# EAGLE design FilamentMonitor-1.0 (EAGLE 7.4.0)
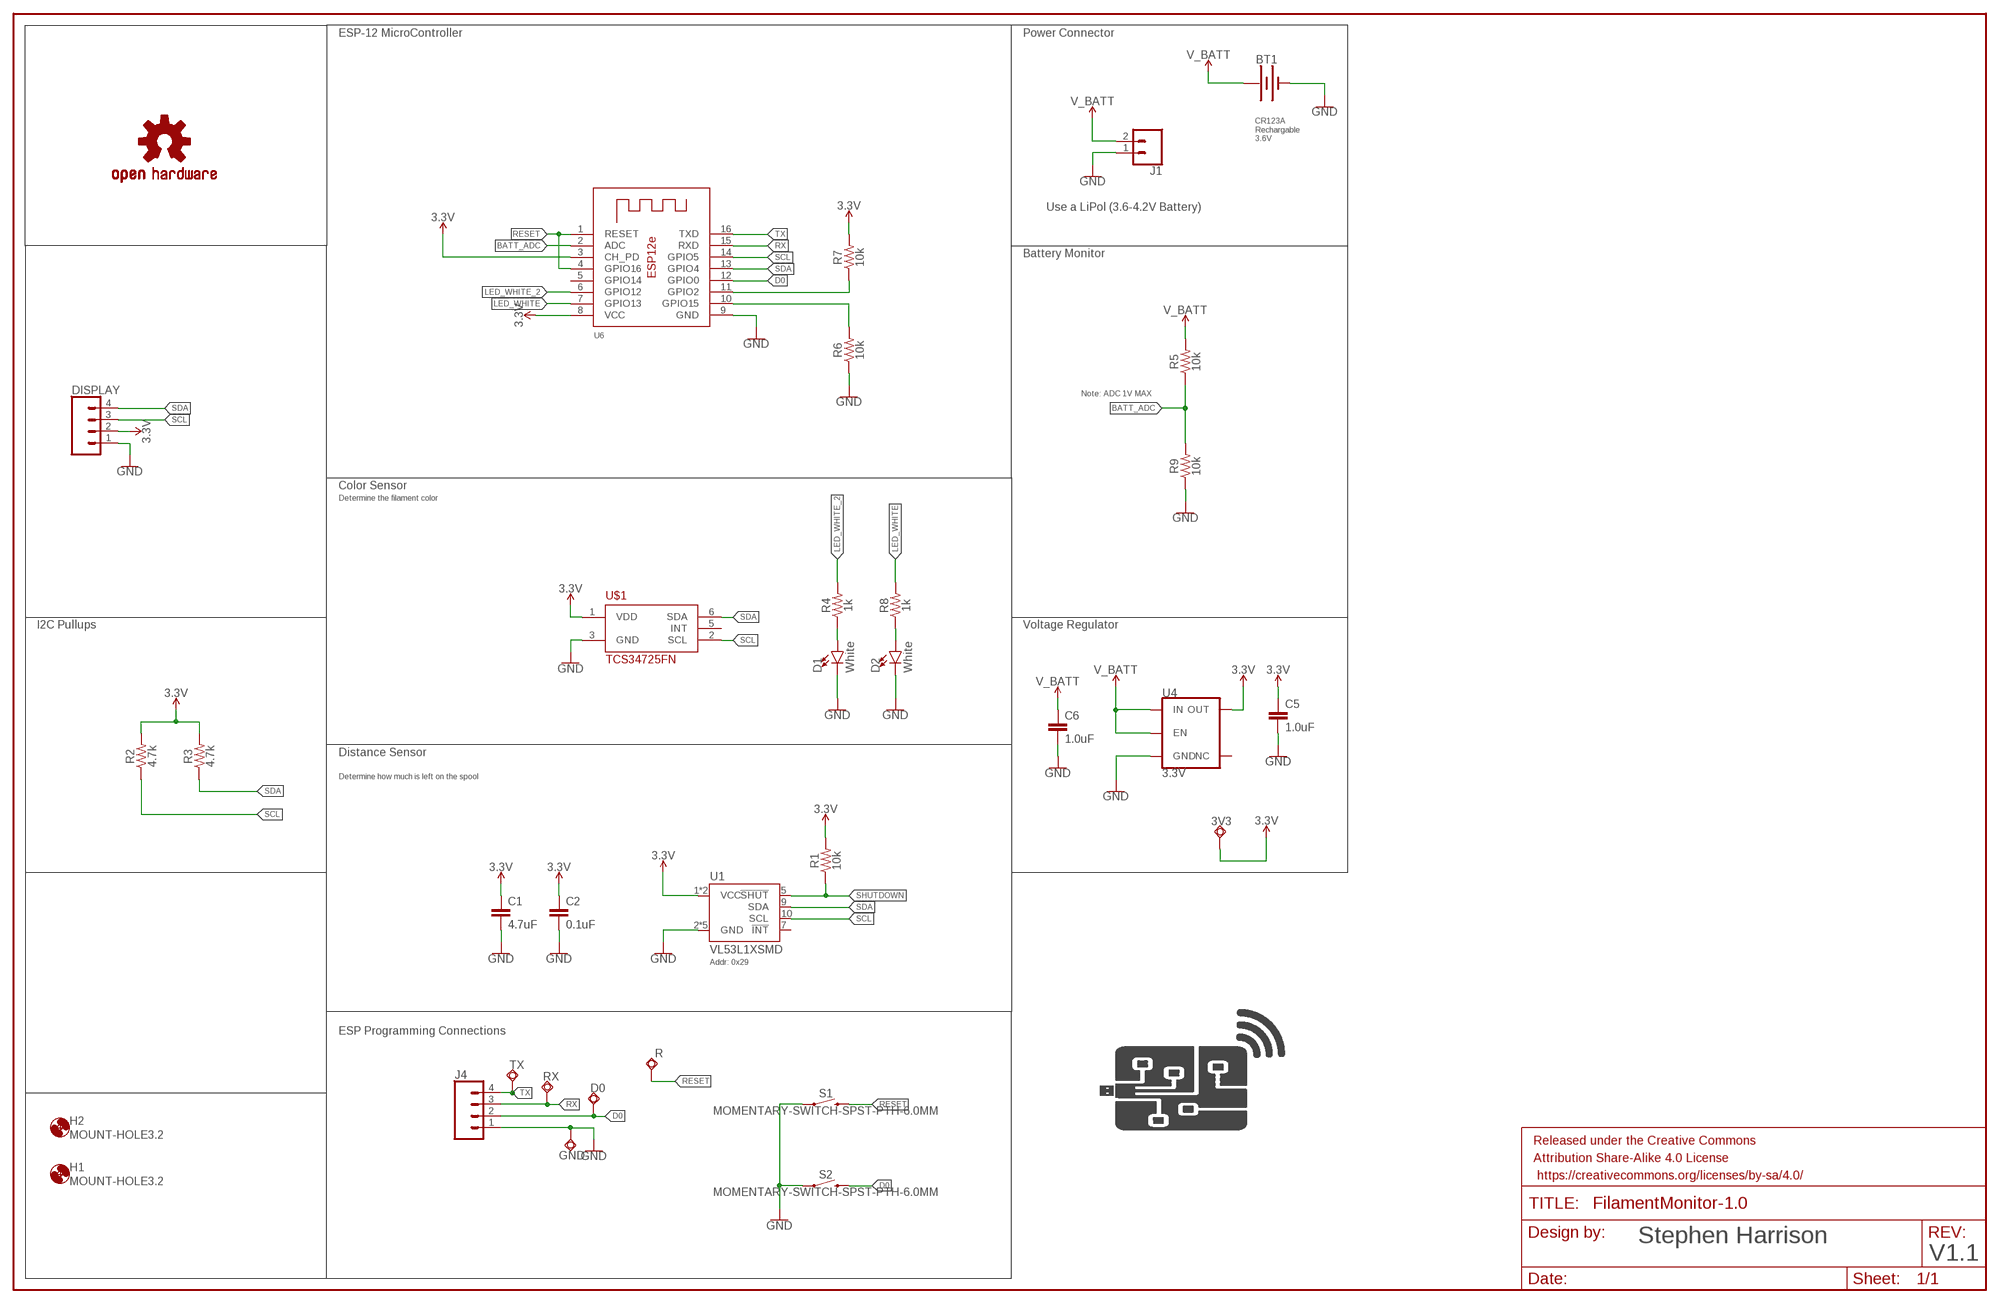
[diagram p0: schematic, sheet 1]

## Parts
3V3  TPSQTP10SQ  [TP10SQ]
BT1  BATTERY-16340  [BATTERY_16340-HOLDER]
C1  4.7uF  4.7UF-0603-6.3V-(10%)  [0603]
C2  0.1uF  0.1UF-0603-25V-5%  [0603]
C5  1.0uF  0.1UF-0603-25V-5%  [0603]
C6  1.0uF  0.1UF-0603-25V-5%  [0603]
D0  TPSQTP10SQ  [TP10SQ]
D1  White  LED-GREEN1206  [LED-1206]
D2  White  LED-GREEN1206  [LED-1206]
DISPLAY  CONN_04  [1X04]
FRAME1  FRAME-LEDGER  [CREATIVE_COMMONS]
GND  TPSQTP10SQ  [TP10SQ]
H1  MOUNT-HOLE3.2  [3,2]
H2  MOUNT-HOLE3.2  [3,2]
J1  CONN_02-JST-2MM-SMT  [JST-2-SMD]
J4  CONN_04  [1X04]
LOGO1  OSHW-LOGOL  [OSHW-LOGO-L]
R  TPSQTP10SQ  [TP10SQ]
R1  10k  10KOHM-0603-1/10W-1%  [0603]
R2  4.7k  4.7KOHM-0603-1/10W-1%  [0603]
R3  4.7k  4.7KOHM-0603-1/10W-1%  [0603]
R4  1k  RESISTOR0805  [0805]
R5  10k  10KOHM-0603-1/10W-1%  [0603]
R6  10k  10KOHM-0603-1/10W-1%  [0603]
R7  10k  10KOHM-0603-1/10W-1%  [0603]
R8  1k  RESISTOR0805  [0805]
R9  10k  10KOHM-0603-1/10W-1%  [0603]
RX  TPSQTP10SQ  [TP10SQ]
S1  MOMENTARY-SWITCH-SPST-PTH-6.0MM  [TACTILE_SWITCH_PTH_6.0MM]
S2  MOMENTARY-SWITCH-SPST-PTH-6.0MM  [TACTILE_SWITCH_PTH_6.0MM]
TX  TPSQTP10SQ  [TP10SQ]
U1  VL53L1XSMD  [VL53L1X]
U4  3.3V  V_REG_AP2112K-3.3V  [SOT23-5]
U6  ESP-12E  [ESP-12E]
U$1  TCS34725FN  TCS3472  [FN-6]
U$2  THINGYSTICKS_LOGO  [THINGYSTICKS_LOGO]

## Nets
3.3V: 3V3.TP C1.1 C2.1 C5.1 DISPLAY.2 R1.2 R2.2 R3.2 R7.2 U1.1(VCC) U1.11(VCC) U4.5(OUT) U6.3(CH_PD) U6.8(VCC) U$1.1(VDD)
ACCEL_INT_2: R7.1 U6.11(GPIO2)
BATT_ADC: R5.1 R9.2 U6.2(ADC)
D0: D0.TP J4.2 S2.3 U6.12(GPIO0)
GND: BT1.P$2(-) C1.2 C2.2 C5.2 C6.2 D1.C D2.C DISPLAY.1 GND.TP J1.1 J4.1 R6.1 R9.1 S1.1 S2.1 U1.2(GND) U1.3(GND) U1.4(GND) U1.6(GND) U1.12(GND) U4.2(GND) U6.9(GND) U$1.3(GND)
GPIO15: R6.2 U6.10(GPIO15)
LED_WHITE: R8.2 U6.7(GPIO13)
LED_WHITE_2: R4.2 U6.6(GPIO12)
N$1: D2.A R8.1
N$2: D1.A R4.1
RESET: R.TP S1.3 U6.1(RESET) U6.4(GPIO16)
RX: J4.3 RX.TP U6.15(RXD)
SCL: DISPLAY.3 R2.1 U1.10(SCL) U6.14(GPIO5) U$1.2(SCL)
SDA: DISPLAY.4 R3.1 U1.9(SDA) U6.13(GPIO4) U$1.6(SDA)
SHUTDOWN: R1.1 U1.5(!SHUT)
TX: J4.4 TX.TP U6.16(TXD)
V_BATT: BT1.P$1(+) C6.1 J1.2 R5.2 U4.1(IN) U4.3(EN)
Unconnected: U1.7(!INT) U4.4(NC) U6.5(GPIO14) U$1.5(INT)

## Notes on the sheet
- ESP-12 MicroController | Power Connector
- CR123A 
  Rechargable
  3.6V
- Use a LiPol (3.6-4.2V Battery)
- Battery Monitor
- Note: ADC 1V MAX
- Color Sensor
- Determine the filament color
- I2C Pullups | Voltage Regulator
- Distance Sensor
- Determine how much is left on the spool
- Addr: 0x29
- ESP Programming Connections
- Stephen Harrison
- V1.1

## Library data of the parts
3V3 D0 GND R RX TX = testpad:TPSQ: Test pad
BT1 = ThingySticks:BATTERY: Battery - Single Cell A variety of battery chemistries, sizes, and footprints. Device List: 20MM_PTH - Coin Cell Battery Holder - 20mm (PTH) <https://www.sparkfun.com/products/783> 12MM_SMD - Coin Cell Battery Holder - 12mm (SMD) <https://www.sparkfun.com/products/10592> 12MM_PTH - Coin Cell Battery Holder - 12mm (PTH) <https://www.sparkfun.com/products/7948> 20MM_SMD - 20mm Coin Cell Battery Holder (SMD) (2 legs) Used on the Big Time Watch Kit <https://www.sparkfun.com/products/11734> 20MM_SMD_4LEGS - Coin Cell Battery Holder - 20mm (SMD) <https://www.sparkfun.com/products/11892> 20MM_SMD_4LEGS_OVERPASTE - Coin Cell Battery Holder - 20mm (SMD) <https://www.sparkfun.com/products/11892> (Over-paste on the legs) 24.5MM_PTH - Coin Cell Battery Holder - 24.5mm (PTH) <https://www.sparkfun.com/products/8863> 9V - 9V Battery Holder - PC Mount Used on the SparkFun SparkPunk Sound Kit <https://www.sparkfun.com/products/11177> and SparkFun SparkPunk Sequencer Kit <https://www.sparkfun.com/products/12707> 18650 - Battery Holder - 18650 (PTH) <https://www.sparkfun.com/products/13113> AA - Battery Holder - 1xAA (PTH) <https://www.sparkfun.com/products/7949> AAA - Battery Holder - 1xAAA (PTH) <https://www.sparkfun.com/products/12718> AA_KIT - Battery Holder - 1xAA (PTH) <https://www.sparkfun.com/products/7949> Special kit package - pads only have exposed copper on one side of the board. AAA_KIT - Battery Holder - 1xAAA (PTH) <https://www.sparkfun.com/products/12718> Special kit package - pads only have exposed copper on one side of the board.
C1 = SparkFun-Capacitors:4.7UF: 4.7µF ceramic capacitors A capacitor is a passive two-terminal electrical component used to store electrical energy temporarily in an electric field.; PROD_ID: CAP-08280
C2 = SparkFun-Capacitors:0.1UF: 0.1µF ceramic capacitors A capacitor is a passive two-terminal electrical component used to store electrical energy temporarily in an electric field.; PROD_ID: CAP-08604
C5 C6 = SparkFun-Capacitors:0.1UF: 0.1µF ceramic capacitors A capacitor is a passive two-terminal electrical component used to store electrical energy temporarily in an electric field.; PROD_ID: CAP-08604; VALUE: 0.1uF
D1 D2 = SparkFun-LED:LED-GREEN: Green SMD LED Used in manufacturing of various products at SparkFun Packages: 0603 - SMD 0603 package [Product Link] <http://www.futureelectronics.com/en/technologies/semiconductors/optoelectronics/leds/Pages/9894312-LTST-C190GKT.aspx?CrossPart=HSMG-C190&IM=0> LilyPad 1206 - SMD1206 LilyPad package [Product Link] <http://www.futureelectronics.com/en/Technologies/Product.aspx?ProductID=IN150NGHARVATEKCORPORATION2049943&IM=0> 1206 - SMD1206 package [Product Link] <http://www.futureelectronics.com/en/technologies/semiconductors/optoelectronics/leds/Pages/8315665-LTST-C150KGKT.aspx?IM=0> 1206 Bottom Mount -SMD 1206 Bottom Mount [Product Link] <http://www.digikey.com/product-detail/en/lite-on-inc/LTST-C230KGKT/160-1456-1-ND/386854> SparkFun Products: Pro Mini 328 -5V <https://www.sparkfun.com/products/821> RedBoard <https://www.sparkfun.com/products/12757> MP3 Trigger <https://www.sparkfun.com/products/13720> Makey Makey <https://www.sparkfun.com/products/11076>; PROD_ID: DIO-00862; VALUE: GREEN
DISPLAY J4 = ThingySticks:CONN_04: Multi connection point. Often used as Generic Header-pin footprint for 0.1 inch spaced/style header connections On any of the 0.1 inch spaced packages, you can populate with these: Break Away Headers - Straight <https://www.sparkfun.com/products/116> (PRT-00116) Break Away Male Headers - Right Angle <https://www.sparkfun.com/products/553> (PRT-00553) Female Headers <https://www.sparkfun.com/products/115> (PRT-00115) Break Away Headers - Machine Pin <https://www.sparkfun.com/products/117> (PRT-00117) Break Away Female Headers - Swiss Machine Pin <https://www.sparkfun.com/products/743> (PRT-00743) For SCREWTERMINALS and SPRING TERMINALS visit here: Screw Terimnals on SparkFun.com <https://www.sparkfun.com/search/results?term=Screw+Terminals> (5mm/3.5mm/2.54mm spacing) This device is also useful as a general connection point to wire up your design to another part of your project. Our various solder wires solder well into these plated through hole pads. Hook-Up Wire - Assortment (Stranded, 22 AWG) <https://www.sparkfun.com/products/11375> (PRT-11375) Hook-Up Wire - Assortment (Solid Core, 22 AWG) <https://www.sparkfun.com/products/11367> (PRT-11367) View the entire wire category on our website here <https://www.sparkfun.com/categories/141> Special notes: Molex polarized connector foot print use with SKU : PRT-08231 with associated crimp pins and housings. 1MM SMD Version SKU: PRT-10208; PROD_ID: CONN-09696
FRAME1 = SparkFun-Aesthetics:FRAME-LEDGER: Schematic Frame - Ledger Standard 11x14 US Ledger frame
H1 H2 = holes:MOUNT-HOLE: MOUNTING HOLE with drill center marker
J1 = SparkFun-Connectors:CONN_02: Multi connection point. Often used as Generic Header-pin footprint for 0.1 inch spaced/style header connections On any of the 0.1 inch spaced packages, you can populate with these: Break Away Headers - Straight <https://www.sparkfun.com/products/116> (PRT-00116) Break Away Male Headers - Right Angle <https://www.sparkfun.com/products/553> (PRT-00553) Female Headers <https://www.sparkfun.com/products/115> (PRT-00115) Break Away Headers - Machine Pin <https://www.sparkfun.com/products/117> (PRT-00117) Break Away Female Headers - Swiss Machine Pin <https://www.sparkfun.com/products/743> (PRT-00743) For SCREWTERMINALS and SPRING TERMINALS visit here: Screw Terimnals on SparkFun.com <https://www.sparkfun.com/search/results?term=Screw+Terminals> (5mm/3.5mm/2.54mm spacing) This device is also useful as a general connection point to wire up your design to another part of your project. Our various solder wires solder well into these plated through hole pads. Hook-Up Wire - Assortment (Stranded, 22 AWG) <https://www.sparkfun.com/products/11375> (PRT-11375) Hook-Up Wire - Assortment (Solid Core, 22 AWG) <https://www.sparkfun.com/products/11367> (PRT-11367) View the entire wire category on our website here <https://www.sparkfun.com/categories/141> Special notes: Molex polarized connector foot print use with: PRT-08233 with associated crimp pins and housings. 2.54_SCREWTERM for use with PRT-10571. 3.5mm Screw Terminal footprints for PRT-08084 5mm Screw Terminal footprints for use with PRT-08432; PROD_ID: CONN-11443
LOGO1 = SparkFun-Aesthetics:OSHW-LOGO: Open-Source Hardware (OSHW) Logo This logo indicates the piece of hardware it is found on incorporates a OSHW license and/or adheres to the definition of open source hardware found here: http://freedomdefined.org/OSHW
R1 R5-R7 R9 = SparkFun-Resistors:10KOHM: 10kΩ resistor A resistor is a passive two-terminal electrical component that implements electrical resistance as a circuit element. Resistors act to reduce current flow, and, at the same time, act to lower voltage levels within circuits. - Wikipedia; PROD_ID: RES-00824
R2 R3 = SparkFun-Resistors:4.7KOHM: 4.7kΩ resistor A resistor is a passive two-terminal electrical component that implements electrical resistance as a circuit element. Resistors act to reduce current flow, and, at the same time, act to lower voltage levels within circuits. - Wikipedia; PROD_ID: RES-07857
R4 R8 = SparkFun-Resistors:RESISTOR: Generic Resistor Package
S1 S2 = SparkFun-Switches:MOMENTARY-SWITCH-SPST: Momentary Switch (Pushbutton) - SPST Normally-open (NO) SPST momentary switches (buttons, pushbuttons). Variants PTH-12MM - 12mm square, through-hole Momentary Pushbutton Switch - 12mm Square <https://www.sparkfun.com/products/9190> (COM-09190) PTH-6.0MM, PTH-6.0MM-KIT - 6.0mm square, through-hole Mini Pushbutton Switch <https://www.sparkfun.com/products/97> (COM-00097) KIT package intended for soldering kit's - only one side of pads' copper is exposed. PTH-RIGHT-ANGLE-KIT - Right-angle, through-hole Right Angle Tactile Button <https://www.sparkfun.com/products/10791> - Used on SparkFun BigTime Watch Kit <https://www.sparkfun.com/products/11734> SMD-12MM - 12mm square, surface-mount Tactile Button - SMD (12mm) <https://www.sparkfun.com/products/12993> (COM-12993) Used on SparkFun PicoBoard <https://www.sparkfun.com/products/11888> SMD-4.5MM - 4.5mm Square Trackball Switch Used on SparkFun Blackberry Trackballer Breakout <https://www.sparkfun.com/products/13169> SMD-4.6MMX2.8MM - 4.60mm x 2.80mm, surface mount Used on SparkFun SAMD21 Mini Breakout <https://www.sparkfun.com/products/13664> SMD-5.2MM, SMD-5.2-REDUNDANT - 5.2mm square, surface-mount Mini Pushbutton Switch - SMD <https://www.sparkfun.com/products/8720> (COM-08720) Used on Arduino Pro Mini <https://www.sparkfun.com/products/11114> REDUNDANT package connects both switch circuits together SMD-6.0X3.5MM - 6.0 x 3.5mm, surface mount Momentary Reset Switch SMD <https://www.sparkfun.com/products/8229> (COM-08229) SMD-6.2MM-TALL - 6.2mm square, surface mount Tactile Button - SMD (6mm) <https://www.sparkfun.com/products/12992> Used on SparkFun Digital Sandbox <https://www.sparkfun.com/products/12651> SMD-RIGHT-ANGLE - Right-angle, surface mount Used on SparkFun Block for Intel® Edison - Arduino <https://www.sparkfun.com/products/13036>; PROD_ID: SWCH-08441; SF_SKU: COM-00097
U1 = SparkFun-Sensors:VL53L1X: STMicroelectronics VL53L1X - 400 cm IR Laser ToF Sensor VL53L1X is a state-of-the-art ToF laser-ranging sensor, enhancing the ST FlightSense product family. It is the fastest miniature ToF sensor currently on the market with accurate ranging up to 4 m and fast ranging frequency (up to 50 Hz). Housed in a miniature and reflowable package, it integrates a single photon avalanche diode (SPAD) receiving array, a 940 nm invisible laser Class 1 emitter, physical infrared filters, and optics to achieve the best ranging performance in various ambient lighting conditions with a range of cover window options.; PROD_ID: IC-13960
U4 = SparkFun-IC-Power:V_REG_AP2112: AP2112 - 600mA CMOS LDO Regulator w/ Enable The AP2112 is CMOS process low dropout linear regulator with enable function, the regulator delivers a guaranteed 600mA (min.) continuous load current. Features Output Voltage Accuracy: ±1.5% Output Current: 600mA (Min.) Foldback Short Current Protection: 50mA Enable Function to Turn ON/OFF VOUT Low Dropout Voltage (3.3V): 250mV (Typ.) @IOUT=600mA Excellent Load Regulation: 0.2%/A (Typ.) Excellent Line Regulation: 0.02%/V (Typ.) Low Quiescent Current: 55μA (Typ.) Low Standby Current: 0.01μA (Typ.) Low Output Noise: 50μVRMS PSRR: 100Hz -65dB, 1kHz -65dB OTSD Protection Stable with 1.0μF Flexible Cap: Ceramic, Tantalum and Aluminum Electrolytic Operation Temperature Range: -40°C to 85°C ESD: MM 400V, HBM 4000V; PROD_ID: VREG-12457
U6 = kanflo:ESP-12E: ESP12e module This is a copy of AdaFruit's device with correct pin order for GPIO4 and GPIO5.
U$1 = ThingySticks:TCS3472; COST: 2.18; MFG: TCS34725FN; MOUSER: 985-TCS34725FN
U$2 = ThingySticks:THINGYSTICKS_LOGO

## Board
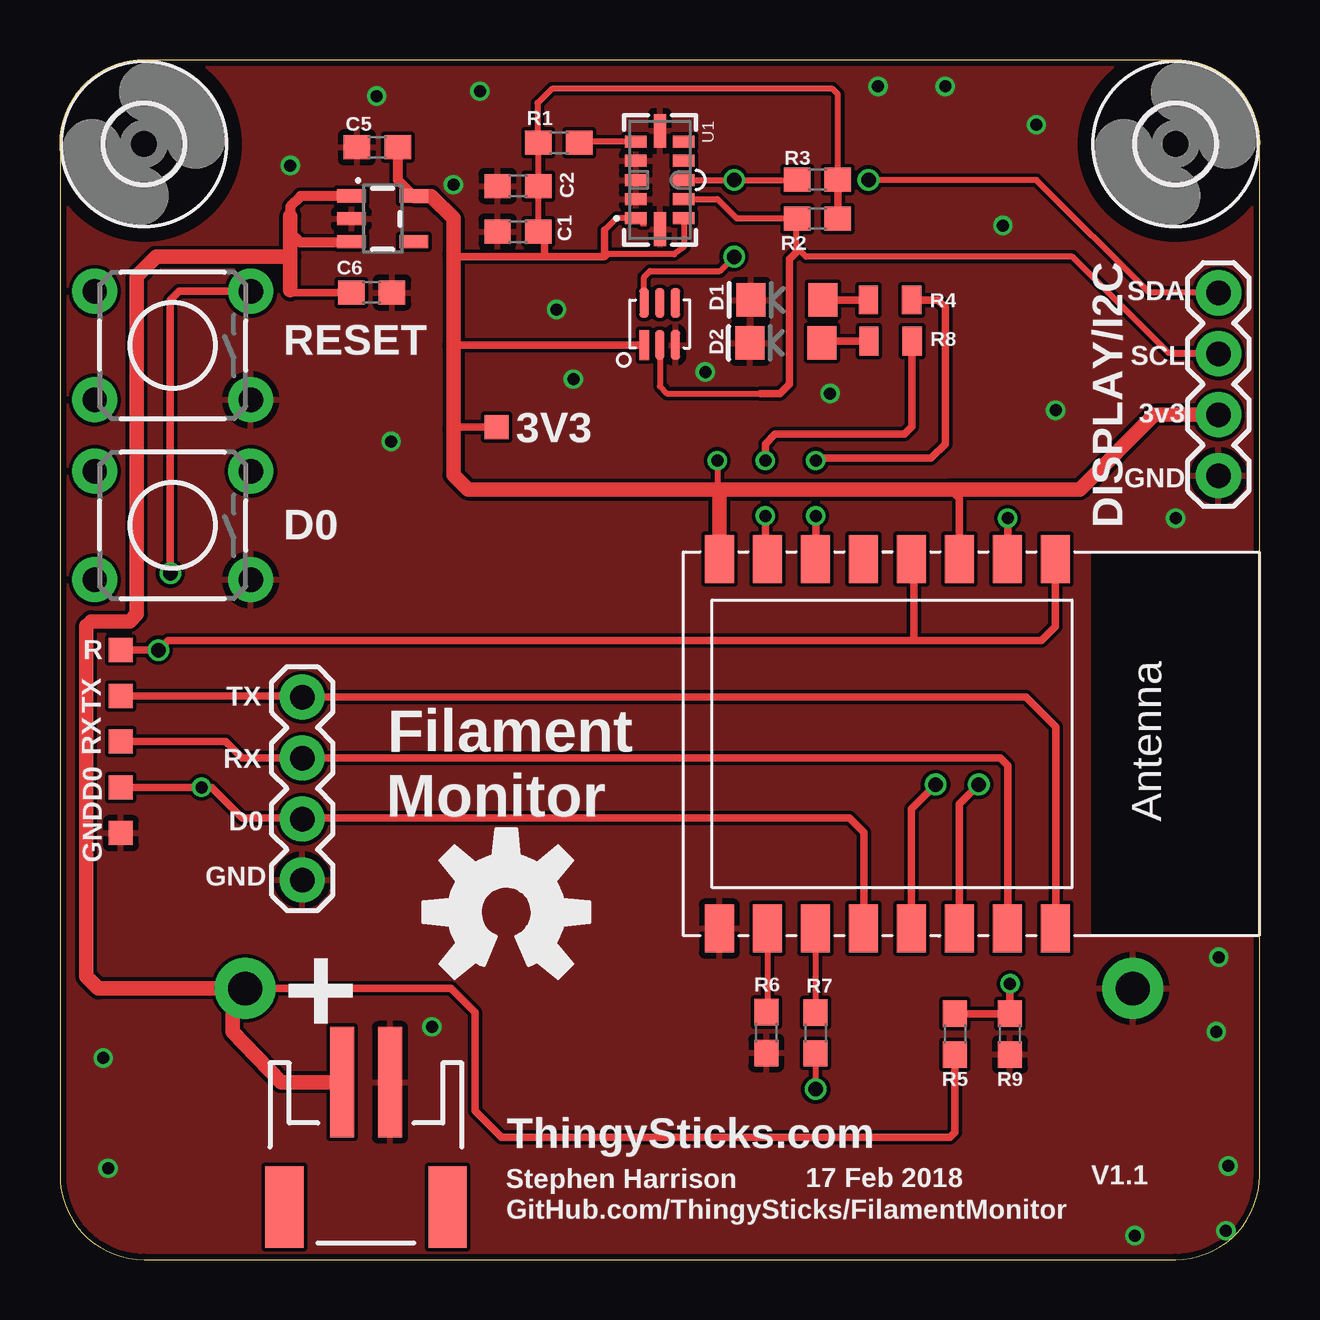
[diagram p1: board, top side]
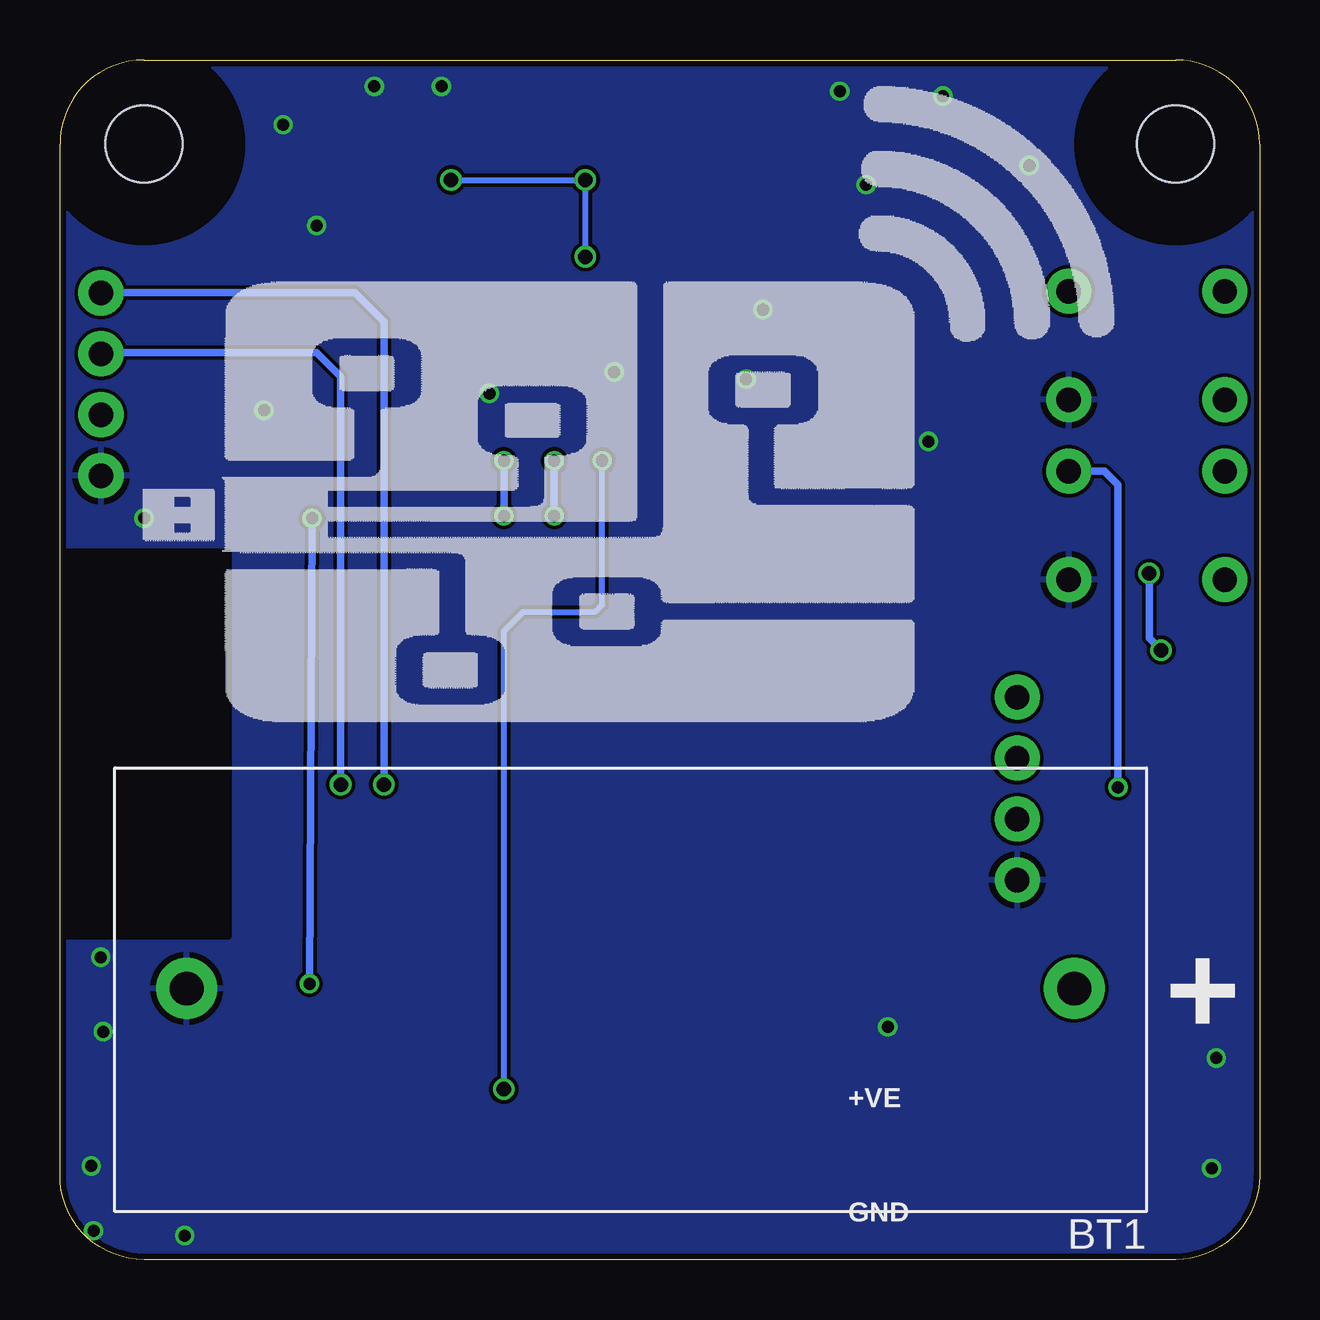
[diagram p2: board, bottom side, seen from below]

Size 50 x 50 mm. Coordinates in mm from the lower left corner, seen from the top.
Outline: 3.5,0 46.5,0 arc90 50,3.5 50,46.5 arc90 46.5,50 3.5,50 arc90 0,46.5 0,3.5 arc90 3.5,0
Copper layers (1*16): Top 0.035mm / dielectric 1.5mm / Bottom 0.035mm
Design rules "dirt_cheap_dirty_boards.v1.1": minimum track width 6mil, minimum drill 12mil, track to track 6mil, track to pad 6mil, pad to pad 6mil, via to via 6mil, smd to smd 0mil, copper to edge 10mil, drill to drill 10mil, minimum pad ring 10mil, minimum via ring 6mil, stop-mask expansion 2mil, vias tented up to drill 25mil, thermal gap 10mil

### Footprints (pad centres in the part's own frame; a part is rotated, then mirrored left to right if it is on the bottom)
TP10SQ = smd 1 x 1: TP 0,0
BATTERY_16340-HOLDER = drill 1.4 pad 2.54: P$1 3,9.2; P$2 40,9.2
0603 = smd 1.1 x 1: 1 -0.85,0; 2 0.85,0
LED-1206 = smd 1.2 x 1.4: A -1.5,0; C 1.5,0
1X04 = drill 1.016 pad 1.88: 1 0,0; 2 2.54,0; 3 5.08,0; 4 7.62,0
3,2 = hole 3.2: 0,0
JST-2-SMD = smd 1 x 4.6: 1 -1,-3.7; 2 1,-3.7 | smd 1.6 x 3.4: NC1 -3.4,1.5; NC2 3.4,1.5
0805 = smd 0.8 x 1.2: 1 -0.9,0; 2 0.9,0
TACTILE_SWITCH_PTH_6.0MM = drill 1.016 pad 1.88: 1 -3.251,2.261; 2 3.251,2.261; 3 -3.251,-2.261; 4 3.251,-2.261
VL53L1X = smd 0.5 x 0.9: 1 1.6,-1; 2 0.8,-1; 3 0,-1; 4 -0.8,-1; 5 -1.6,-1; 7 -1.6,1; 8 -0.8,1; 9 0,1; 10 0.8,1; 11 1.6,1 | smd 1.4 x 0.5: 6 -2.05,0; 12 2.05,0
SOT23-5 = smd 0.55 x 1.2: 1 -0.95,-1.3; 2 0,-1.3; 3 0.95,-1.3; 4 0.95,1.3; 5 -0.95,1.3
ESP-12E = smd 2 x 1.2: 1 -7.7,4.5; 2 -7.7,2.5; 3 -7.7,0.5; 4 -7.7,-1.5; 5 -7.7,-3.5; 6 -7.7,-5.5; 7 -7.7,-7.5; 8 -7.7,-9.5; 9 7.7,-9.5; 10 7.7,-7.5; 11 7.7,-5.5; 12 7.7,-3.5; 13 7.7,-1.5; 14 7.7,0.5; 15 7.7,2.5; 16 7.7,4.5
FN-6 = smd 1.25 x 0.4: 1 -0.875,0.65; 2 -0.875,0; 3 -0.875,-0.65; 4 0.875,-0.65; 5 0.875,0; 6 0.875,0.65

### Placement (x,y rotation side)
3V3  18.2,34.7 0 top
BT1  4.72,20.5 180 bottom
C1  19.09,42.84 180 top
C2  19.09,44.75 180 top
C5  13.22,46.35 180 top
C6  12.99,40.3 0 top
D0  2.54,19.68 0 top
D1  30.3,40 180 top
D2  30.27,38.2 180 top
DISPLAY  48.29,32.67 90 top
FRAME1  20.95,-7.62 0 top  (outside the outline)
GND  2.54,17.78 180 top
H1  3.5,46.5 0 top
H2  46.5,46.5 0 top
J1  12.76,3.69 180 top
J4  10.1,15.82 90 top
LOGO1  18.6,14.47 0 top
R  2.54,25.4 180 top
R1  20.8,46.55 180 top
R2  31.57,43.38 0 top
R3  31.57,45 0 top
R4  34.6,40 0 top
R5  37.3,9.4 270 top
R6  29.44,9.46 90 top
R7  31.5,9.45 270 top
R8  34.62,38.28 0 top
R9  39.6,9.4 90 top
RX  2.54,21.59 0 top
S1  4.7,38.1 180 top
S2  4.7,30.6 180 top
TX  2.54,23.5 0 top
U1  25,45 270 top
U4  13.45,43.38 270 top
U6  36.98,21.5 270 top
U$1  25,39 90 top
U$2  47.6,21.6 0 bottom

### Tracks (layer width: path | path; a pad name or v marks a point on that pad's centre or on a via)
3.3V  (via drill 0.5, 0.6)
  Top 0.254: U1.1 23.2,43.4 22.7,42.9 | 24.32,38.1 U$1.1 | U1.11 26,42.2 25.6,41.9 22.8,41.9 | 20.2,42.9 C1.1 C2.1 R1.2 19.9,46.6 19.9,48.2 20.5,48.8 32.2,48.8 32.42,48.58 R2.2 | R7.2 v31.5,7.11 v31.5,7.1 | v27.4,33.3 27.4,32.2 27.3,32.1
  Top 0.305: R2.2 R3.2 | U$1.1 16.43,38.12 16.4,38.1 | 20.3,41.8 22.7,41.8 22.8,41.9 22.7,42 22.7,42.9 | 20.3,41.8 16.5,41.8 16.4,41.9 | 20.2,42.9 20.2,41.91 20.3,41.8 | 3V3.TP 16.5,34.7 16.4,34.6 | U6.3 37.48,31.71 37.1,32.1
  Top 0.406: C5.1 14.07,45.01 U4.5
  Top 0.61: U4.5 15.47,44.33 16.4,43.4 16.4,41.9 16.4,38.1 16.4,34.6 16.4,32.7 17,32.1 27.3,32.1 | 27.5,29.21 U6.8 27.48,31.91 27.3,32.1 | DISPLAY.2 45.61,35.21 42.5,32.1 37.1,32.1 27.3,32.1
  Bottom 0.254: v31.5,7.1 31.5,26.2 30.7,27 27.7,27 27.4,27.3 v27.4,33.3
ACCEL_INT_2
  Top 0.254: U6.11 31.48,10.3 R7.1
BATT_ADC  (via drill 0.5)
  Top 0.305: v39.5,30.9 39.5,29.21 U6.2 | v39.6,11.5 R9.2 R5.1
  Bottom 0.305: v39.6,11.5 v39.5,30.9
D0  (via drill 0.5)
  Top 0.305: U6.12 33.5,13.81 33.5,17.8 32.9,18.4 10.06,18.4 | D0.TP v5.9,19.68 6.32,19.68 7.6,18.4 10.06,18.4 | 10.06,18.4 J4.2
  Bottom 0.305: S2.3 6.46,32.86 5.9,32.3 v5.9,19.68
GND  (via drill 0.5)
  other vias: 26.9,37 20.7,39.6 32.1,36.1 16.4,44.8 17.5,48.7 13.2,48.5 9.6,45.6 34.1,48.9 36.9,48.9 40.7,47.3 39.3,43.1 41.5,35.4 46.5,30.9 48.3,12.6 48.2,9.5 48.7,3.9 48.6,1.2 44.8,1 13.8,34.1 15.5,9.7 2,3.8 1.8,8.4 21.4,36.7
  pour Top: 0,50 50,50 50,0 0,0
  pour Bottom (isolate 0.152, rank 4): 0,0 50,0 50,1.27 50.1,50 0,50.1
GPIO15
  Top 0.254: U6.10 29.48,10.36 R6.2
LED_WHITE  (via drill 0.5)
  Top 0.305: 29.39,29.3 U6.7 29.4,29.29 v29.4,31 | R8.2 35.52,34.72 35.2,34.4 29.8,34.4 29.4,34 v29.4,33.3
  Bottom 0.305: v29.4,33.3 v29.4,31
LED_WHITE_2  (via drill 0.5)
  Top 0.305: R4.2 36.6,40 36.9,39.7 36.9,34 36.3,33.4 31.6,33.4 v31.5,33.3 | v31.5,31 31.5,29.21 U6.6
  Bottom 0.305: v31.5,33.3 v31.5,31
N$1
  Top 0.305: R8.1 31.84,38.28 D2.A
N$2
  Top 0.305: D1.A R4.1
RESET  (via drill 0.6)
  Top 0.305: R.TP v4.1,25.4 4.5,25.8 35.6,25.8 | U6.1 41.48,26.39 40.9,25.8 35.6,25.8 | U6.4 35.6,29.09 35.6,25.8 | S1.3 4.96,40.36 4.6,40 v4.6,28.6
  Bottom 0.305: v4.6,28.6 4.6,25.9 v4.1,25.4
RX
  Top 0.305: RX.TP 6.91,21.59 7.6,20.9 J4.3 39.2,20.9 39.5,20.6 39.5,13.81 U6.15
SCL  (via drill 0.6)
  Top 0.254: U1.10 27.4,44.2 28.2,43.4 30.7,43.4 R2.1 30.7,43.36 30.7,42.2 30.8,42.1 31.1,41.8 42.2,41.8 46.2,37.8 47.8,37.8 47.75,37.75 | U$1.2 25,36.4 25.3,36.1 29.2,36.1 | DISPLAY.3 47.75,37.75 | 46.35,37.75 47.75,37.75
  Top 0.305: U6.14 37.48,18.98 v38.3,19.8 | 29.2,36.1 30,36.1 30.4,36.5 30.4,41.7 30.8,42.1
  Bottom 0.305: v38.3,19.8 38.3,36.8 39.3,37.8 48.24,37.8 DISPLAY.3
SDA  (via drill 0.6)
  Top 0.254: U1.9 v28.1,45 R3.1 | U$1.6 24.35,40.95 24.6,41.2 27.5,41.2 v28.1,41.8 | DISPLAY.4 45.41,40.29 40.7,45 v33.7,45
  Top 0.305: U6.13 35.48,18.79 v36.5,19.8
  Bottom 0.254: v28.1,41.8 v28.1,45 v33.7,45
  Bottom 0.305: v36.5,19.8 36.5,39.1 37.7,40.3 47.79,40.3 | 47.79,40.3 47.8,40.29 | 47.79,40.3 DISPLAY.4
SHUTDOWN
  Top 0.254: U1.5 21.69,46.6 R1.1
TX
  Top 0.305: U6.16 41.5,13.81 41.5,22.2 40.26,23.44 J4.4 10.04,23.5 TX.TP
V_BATT
  Top 0.305: C6.1 9.7,40.3 9.6,40.4 | R5.2 37.3,5.3 37.1,5.1 18.4,5.1 17.3,6.2 17.3,10.3 16.3,11.3 BT1.P$1
  Top 0.406: U4.1 10.03,44.33 9.6,43.9 9.6,43.5 9.6,42.8 10,42.4 12.12,42.4 U4.3
  Top 0.61: J1.2 9.21,7.39 7.2,9.5 7.2,11.28 BT1.P$1 1.6,11.3 1.1,11.8 1.1,26.4 1.3,26.6 2.9,26.6 3.2,26.9 3.2,41 4,41.8 9.6,41.8 | 9.6,40.4 9.6,41.8 | 9.6,41.8 9.6,43.5

### Text on the board
tNames: SDA | RESET | SCL | 3v3 | GND | D0 | DISPLAY/I2C | TX | RX | Filament | D0 | Monitor | GND | ThingySticks.com | Stephen Harrison | 17 Feb 2018 | V1.1 | GitHub.com/ThingySticks/FilamentMonitor
bNames: +VE | GND